# Altium project ECE453-PWR.PrjPcb
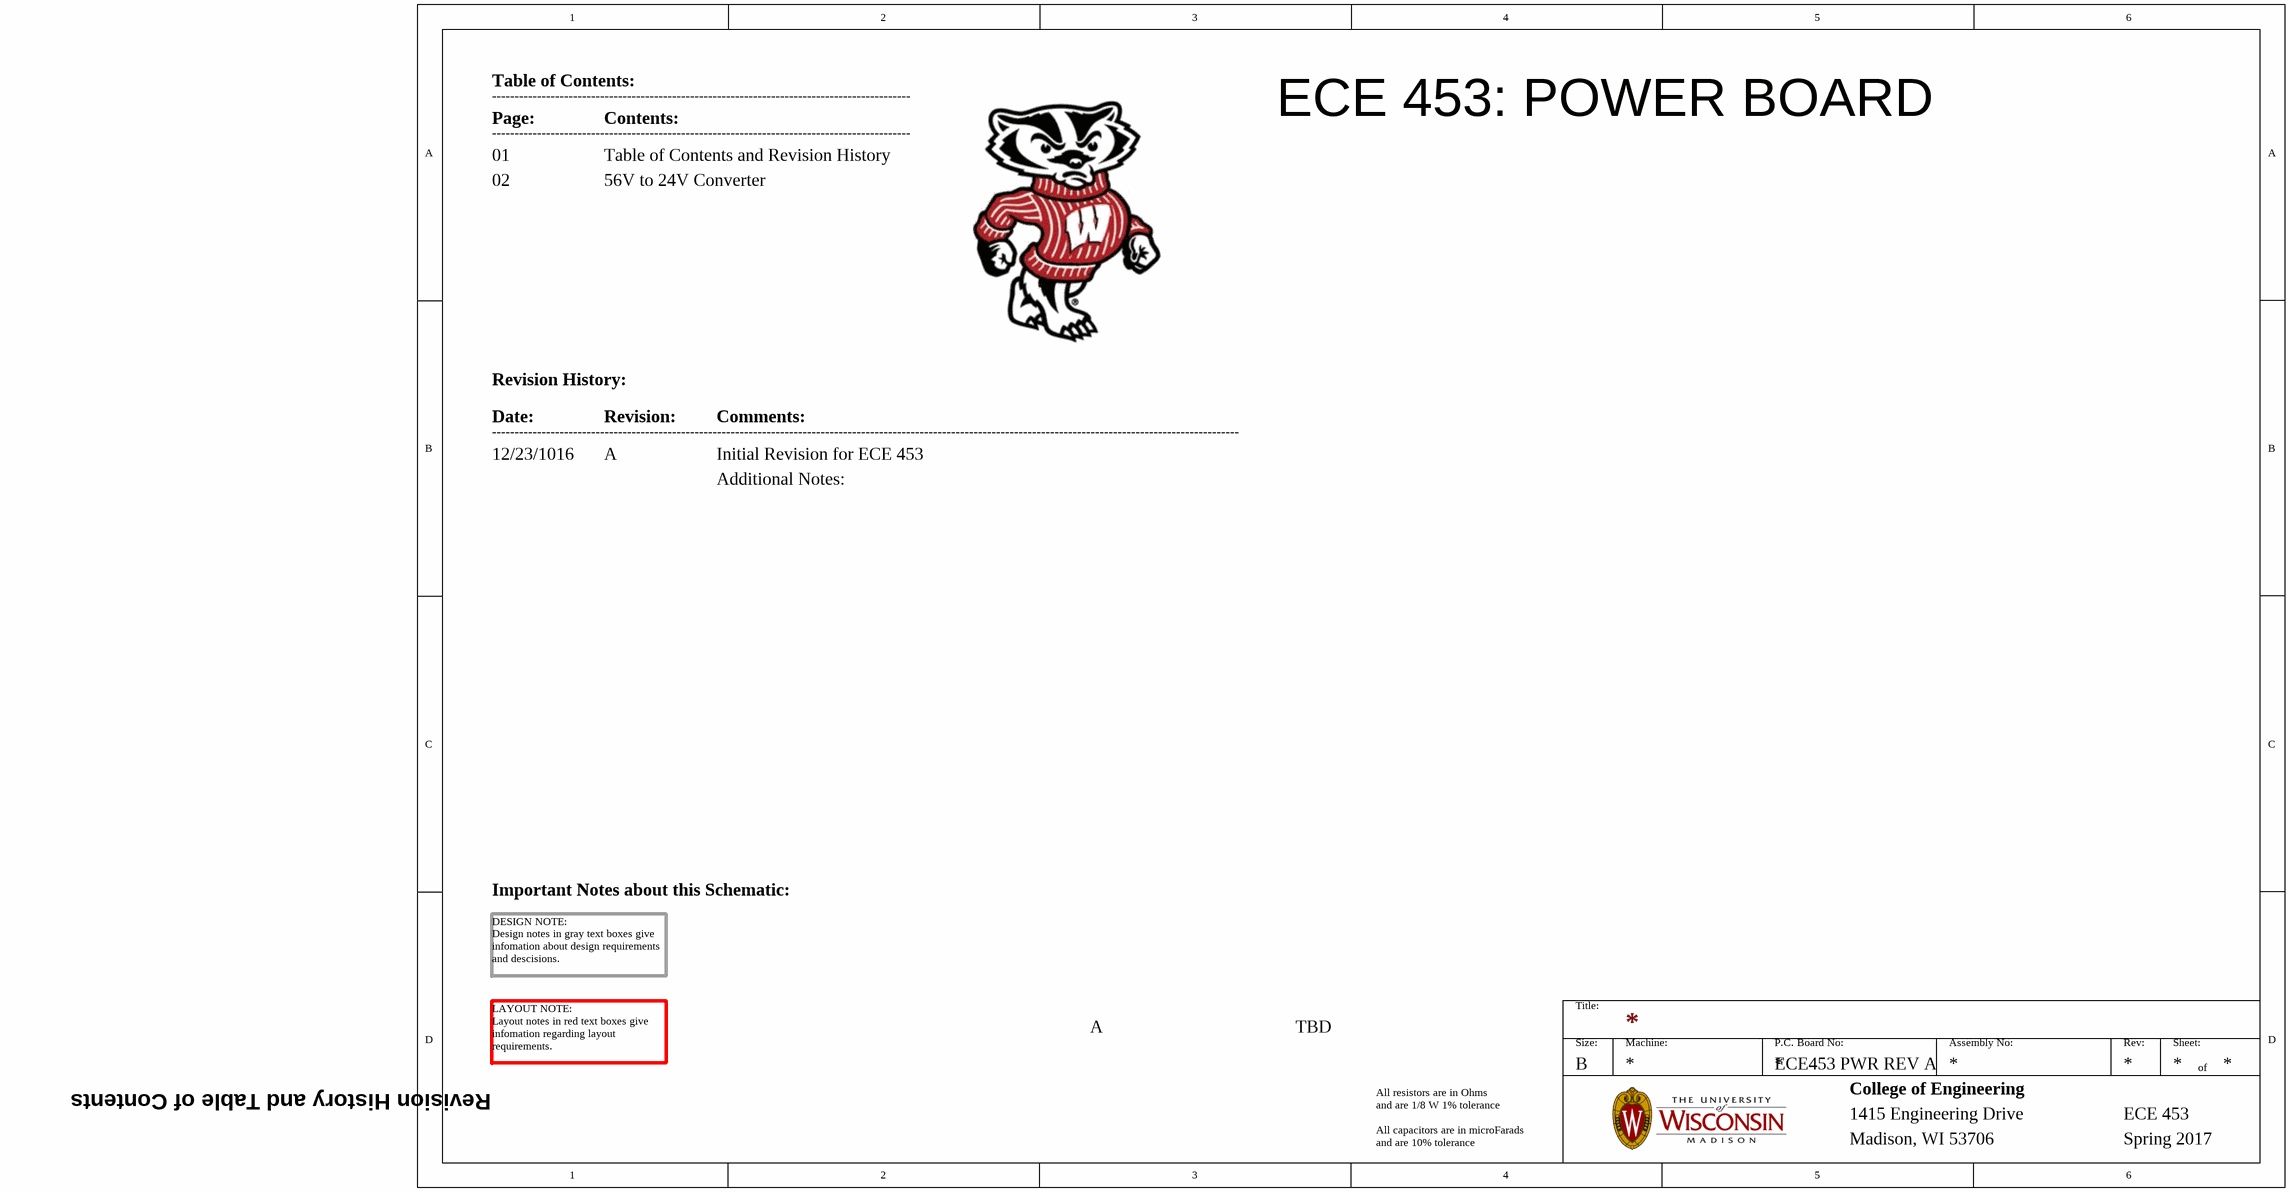
[diagram p0: 01 Revision History and Contents.SchDoc]
3 sheets, 35 parts. Net scope: global (net labels, ports and power ports of the same name join across sheets).
Board file: ECE453_PWR.PcbDoc
Sheets:
  01 Revision History and Contents.SchDoc
  02 56V-24V.SchDoc
  03 24V-5V.SchDoc

## Sheet 01 Revision History and Contents.SchDoc
size B

### Parts
PCB1  value ECE453 PWR REV A  (hidden comment: PMOD F14 REV A)  (mechanical)

### Notes on the sheet
- Table of Contents:
- Page:
- ---------------------------------------------------------------------------------------------
- Contents:
- ECE 453: POWER BOARD
- 01
- 02
- Table of Contents and Revision History
- 56V to 24V Converter
- Revision History:
- Date:
- 12/23/1016
- ----------------------------------------------------------------------------------------------------------------------------------------------------------------------
- Revision:
- A
- Comments:
- Initial Revision for ECE 453
- Additional Notes:
- Important Notes about this Schematic:
- DESIGN NOTE:
  Design notes in gray text boxes give infomation about design requirements and descisions.
- Revision History and Table of Contents
- LAYOUT NOTE:
  Layout notes in red text boxes give infomation regarding layout requirements.
- TBD
- All resistors are in Ohms
- and are 1/8 W 1% tolerance
- All capacitors are in microFarads
- and are 10% tolerance
- ECE 453
- Spring 2017
- Title:
- Size:
- B
- Machine:
- P.C. Board No:
- Assembly No:
- Rev:
- Sheet:
- of
- College of Engineering
- 1415 Engineering Drive
- Madison, WI 53706

### Library data of the parts
PCB1 = PMOD F14 Rev A Bare PCB: ECE 453 Digital Themometer PMOD F14 Rev A Bare PCB; Manufacturer 1: TBD; Supplier 1: TBD; Supplier Part Number 1: N/A; Manufacturer Part Number 1: PMOD F14 REV A; Supplier Unit Price 1: 33; Package: N/A; Tolerance: N/A; Rating: N/A

## Sheet 02 56V-24V.SchDoc: Mezzanine Power
size B; Author: JSK; Revision: A; SheetNumber: 2; SheetTotal: 2; AssemblyNumber: ECE453 Power; CurrentDate: 1/09/2018
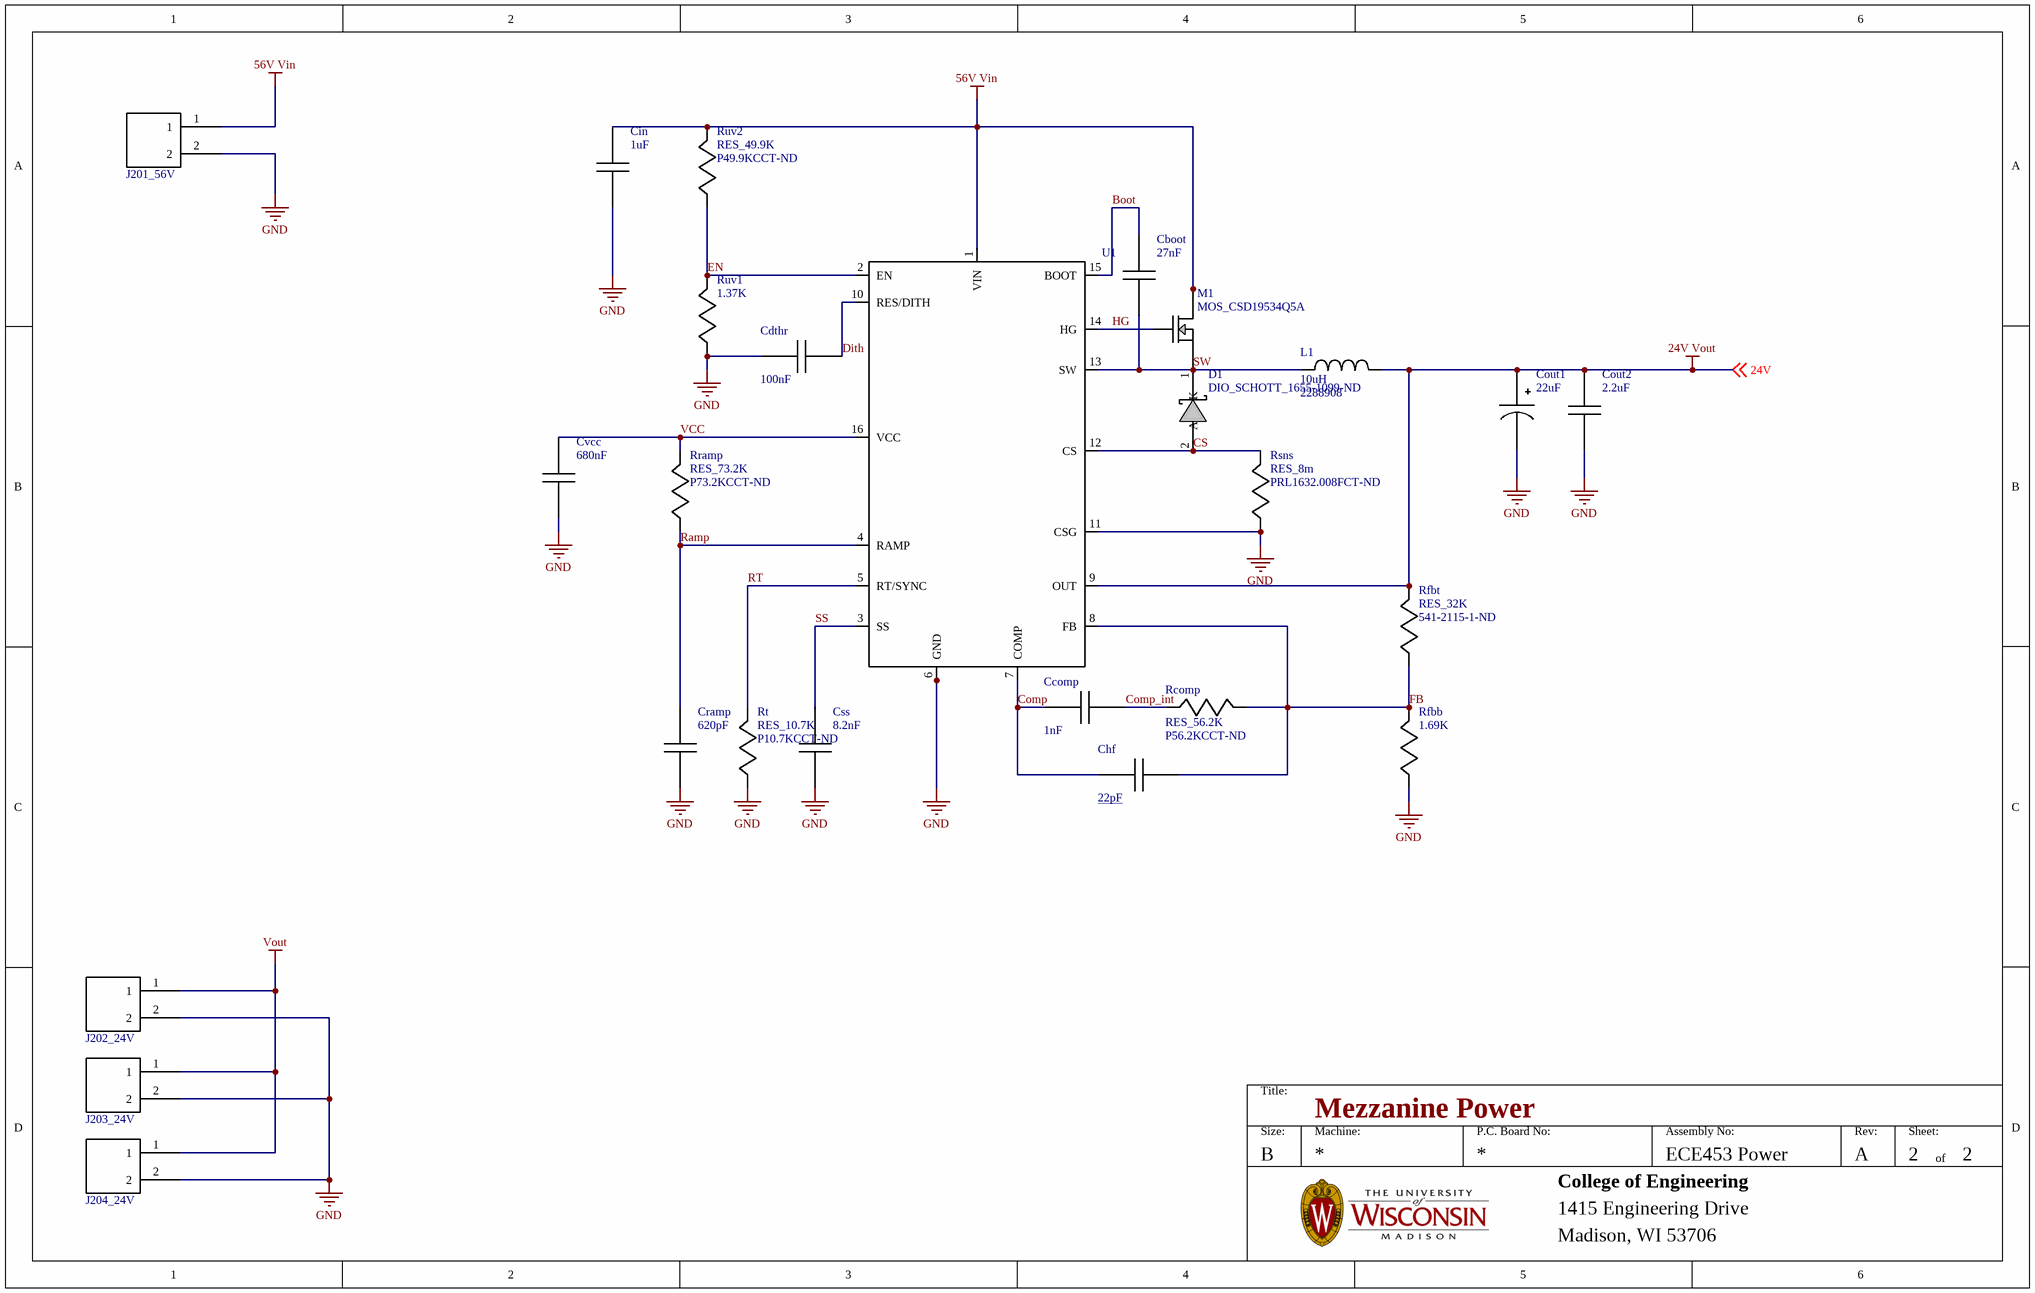
[diagram p1: 02 56V-24V.SchDoc]

### Parts
Cboot  Capacitance: 27nF  [CAP_1812]  (hidden comment: CAP_27nF)
Ccomp  Capacitance: 1nF  [CAP_0805]  (hidden comment: CAP_1nF)
Cdthr  Capacitance: 100nF  [CAP_0805]  (hidden comment: CAP_100nF)
Chf  Capacitance: 22pF  [CAP_0805]  (hidden comment: CAP_22pF)
Cin  Capacitance: 1uF  [CAP_1207]  (hidden comment: CAP_1uF)
Cout1  Capacitance: 22uF  [CAP_RAD_35SVPF22M]  (hidden comment: PCAP_22uF)
Cout2  Capacitance: 2.2uF  [CAP_0805]  (hidden comment: CAP_2.2uF)
Cramp  Capacitance: 620pF  [CAP_0805]  (hidden comment: CAP_620pF)
Css  Capacitance: 8.2nF  [CAP_0805]  (hidden comment: CAP_8.2nF)
Cvcc  Capacitance: 680nF  [CAP_1207]  (hidden comment: CAP_680nF)
D1  DIO_SCHOTT_1655-1099-ND  [DIO_SCHOTT_MBRF10200]
J201_56V  TERMINAL_SCREW_2x1  [TERM_2Pin]  (value not drawn)
J202_24V  TERMINAL_SCREW_2x1  [TERM_2Pin]  (value not drawn)
J203_24V  TERMINAL_SCREW_2x1  [TERM_2Pin]  (value not drawn)
J204_24V  TERMINAL_SCREW_2x1  [TERM_2Pin]  (value not drawn)
L1  Inductance: 10uH  Supplier Part Number 1: 2288908  [IND_SER2900]  (hidden comment: IND_10uH)
M1  MOS_CSD19534Q5A  [MOS_CSD19534Q5A]
Rcomp  RES_56.2K  Supplier Part Number 1: P56.2KCCT-ND  [RES_0805]
Rfbb  Resistance: 1.69K  [RES_0805]  (hidden comment: RES_1.69K)
Rfbt  RES_32K  Supplier Part Number 1: 541-2115-1-ND  [RES_0402]
Rramp  RES_73.2K  Supplier Part Number 1: P73.2KCCT-ND  [RES_0805]
Rsns  RES_8m  Supplier Part Number 1: PRL1632.008FCT-ND  [RES_1206]
Rt  RES_10.7K  Supplier Part Number 1: P10.7KCCT-ND  [RES_0805]
Ruv1  Resistance: 1.37K  [RES_0805]  (hidden comment: RES_1.37K)
Ruv2  RES_49.9K  Supplier Part Number 1: P49.9KCCT-ND  [RES_0805]
U1  BUCK_LM5088QMHX-1/NOP  [BUCK_LM5088]  (value not drawn)

### Nets
24V Vout: Cout1.1(+) Cout2.1 L1.2 Rfbt.1 U1.9(OUT) ; off-sheet 24V  [also labelled 24V]
56V Vin: Cin.1 J201_56V.1 M1.5(Drain) M1.6(Drain) M1.7(Drain) M1.8(Drain) Ruv2.1 U1.1(VIN)
GND: Cdthr.2 Cin.2 Cout1.2(-) Cout2.2 Cramp.2 Css.2 Cvcc.2 J201_56V.2 J202_24V.2 J203_24V.2 J204_24V.2 Rfbb.2 Rsns.2 Rt.2 Ruv1.2 U1.6(GND) U1.11(CSG) U1.17(EP)
Vout: J202_24V.1 J203_24V.1 J204_24V.1
Boot: Cboot.1 U1.15(BOOT)
Comp: Ccomp.2 Chf.2 U1.7(COMP)
Comp_int: Ccomp.1 Rcomp.2
CS: D1.2(A) Rsns.1 U1.12(CS)
Dith: Cdthr.1 U1.10(RES/DITH)
EN: Ruv1.1 Ruv2.2 U1.2(EN)
FB: Chf.1 Rcomp.1 Rfbb.1 Rfbt.2 U1.8(FB)
HG: M1.4(Gate) U1.14(HG)
Ramp: Cramp.1 Rramp.2 U1.4(RAMP)
RT: Rt.1 U1.5(RT/SYNC)
SS: Css.1 U1.3(SS)
SW: Cboot.2 D1.1(K) L1.1 M1.1(Source) M1.2(Source) M1.3(Source) U1.13(SW)
VCC: Cvcc.1 Rramp.1 U1.16(VCC)

### Notes on the sheet
- Title:
- Size:
- B
- Machine:
- P.C. Board No:
- Assembly No:
- Rev:
- Sheet:
- of
- College of Engineering
- 1415 Engineering Drive
- Madison, WI 53706

### Library data of the parts
Cboot = CAP_27nF: Imported; Manufacturer_Part_Number: C1812C273J5GACTU; Vendor: Kemet; Tolerance: ±5%; Voltage - Rated: 50V; Temperature Coefficient: C0G, NP0; Notification: Current market demand for these product types have resulted in fluctuating and extending lead times. Lead times may differ.; Manufacturer_Name: Kemet; RefDes: RefDes; TYPE: TYPE; Value: Value; Supplier 1: Digi-Key; Manufacturer: KEMET; Manufacturer Part Number: C1812C273J5GACTU; RoHS: RoHS Compliant; Category: Capacitors; Stock 1: 1884; Pricing 1: 1=1.94, 10=1.533, 100=1.1499, 500=0.8688 (USD); Packaging: Cut Tape (CT); Part Status: Active; Operating Temperature: -55°C ~ 125°C; Features: Low ESL; Ratings: -; Applications: General Purpose; Failure Rate: -; Mounting Type: Surface Mount, MLCC; Package / Case: 1812 (4532 Metric); Size / Dimension: 0.177" L x 0.126" W (4.50mm x 3.20mm); Height - Seated (Max): -; Thickness (Max): 0.043" (1.10mm); Lead Spacing: -; Lead Style: -; ComponentLink1URL: https://search.kemet.com/component-edge/download/datasheet/C1812C273J5GACTU.pdf; ComponentLink1Description: https://search.kemet.com/component-edge/download/datasheet/C1812C273J5GACTU.pdf; Supplier Part Number 1: 399-5352-1-ND
Ccomp = CAP_1nF: Imported; Manufacturer_Part_Number: C0805C102K5GACTU; Vendor: Kemet; Tolerance: ±10%; Voltage - Rated: 50V; Temperature Coefficient: C0G, NP0; Notification: Current market demand for these product types have resulted in fluctuating and extending lead times. Lead times may differ.; Manufacturer_Name: Kemet; RefDes: RefDes; TYPE: TYPE; Value: Value; Supplier 1: Digi-Key; Manufacturer: KEMET; Manufacturer Part Number: C0805C102K5GACTU; RoHS: RoHS Compliant; Category: Capacitors; Stock 1: 31421; Pricing 1: 1=0.13, 10=0.09, 100=0.0424, 500=0.02972, 1000=0.02461 (USD); Packaging: Cut Tape (CT); Part Status: Active; Operating Temperature: -55°C ~ 125°C; Features: Low ESL; Ratings: -; Applications: General Purpose; Failure Rate: -; Mounting Type: Surface Mount, MLCC; Package / Case: 0805 (2012 Metric); Size / Dimension: 0.079" L x 0.049" W (2.00mm x 1.25mm); Height - Seated (Max): -; Thickness (Max): 0.035" (0.88mm); Lead Spacing: -; Lead Style: -; ComponentLink1URL: https://search.kemet.com/component-edge/download/datasheet/C0805C102K5GACTU.pdf; ComponentLink1Description: https://search.kemet.com/component-edge/download/datasheet/C0805C102K5GACTU.pdf; Supplier Part Number 1: 399-7988-1-ND
Cdthr = CAP_100nF: Imported; Manufacturer_Part_Number: 08053C104JAZ2A; Manufacturer: AVX Corporation; Vendor: AVX; Tolerance: ±5%; Voltage - Rated: 25V; Temperature Coefficient: X7R; Notification: Current market demand for these product types have resulted in fluctuating and extending lead times. Lead times may differ.; Manufacturer_Name: AVX; RefDes: RefDes; TYPE: TYPE; Value: Value; Supplier 1: Digi-Key; Manufacturer Part Number: 08053C104JAZ2A; RoHS: RoHS Compliant; Category: Capacitors; Stock 1: 0; Pricing 1: 4000=0.0864 (USD); Packaging: Tape & Reel (TR); Part Status: Active; Operating Temperature: -55°C ~ 125°C; Features: Soft Termination; Ratings: -; Applications: Boardflex Sensitive; Mounting Type: Surface Mount, MLCC; Package / Case: 0805 (2012 Metric); Size / Dimension: 0.079" L x 0.049" W (2.01mm x 1.25mm); Height - Seated (Max): -; Thickness (Max): 0.037" (0.94mm); Lead Spacing: -; Lead Style: -; ComponentLink1URL: http://datasheets.avx.com/FlexitermMLCC.pdf; ComponentLink1Description: http://datasheets.avx.com/FlexitermMLCC.pdf; Supplier Part Number 1: 08053C104JAZ2A-ND
Chf = CAP_22pF: Imported; Manufacturer_Part_Number: C0805C220K3GACTU; Vendor: Kemet; Tolerance: ±10%; Voltage - Rated: 25V; Temperature Coefficient: C0G, NP0; Notification: Current market demand for these product types have resulted in fluctuating and extending lead times. Lead times may differ.; Manufacturer_Name: Kemet; RefDes: RefDes; TYPE: TYPE; Value: Value; Supplier 1: Digi-Key; Manufacturer: KEMET; Manufacturer Part Number: C0805C220K3GACTU; RoHS: RoHS Compliant; Category: Capacitors; Stock 1: 86290; Pricing 1: 1=0.1, 10=0.072, 100=0.0322, 500=0.02302, 1000=0.01809 (USD); Packaging: Cut Tape (CT); Part Status: Active; Operating Temperature: -55°C ~ 125°C; Features: Low ESL; Ratings: -; Applications: General Purpose; Failure Rate: -; Mounting Type: Surface Mount, MLCC; Package / Case: 0805 (2012 Metric); Size / Dimension: 0.079" L x 0.049" W (2.00mm x 1.25mm); Height - Seated (Max): -; Thickness (Max): 0.035" (0.88mm); Lead Spacing: -; Lead Style: -; ComponentLink1URL: https://search.kemet.com/component-edge/download/datasheet/C0805C220K3GACTU.pdf; ComponentLink1Description: https://search.kemet.com/component-edge/download/datasheet/C0805C220K3GACTU.pdf; Supplier Part Number 1: 399-9190-1-ND
Cin = CAP_1uF: Imported; Manufacturer_Part_Number: C3216X7R2A105K160AA; Manufacturer: TDK Corporation; Vendor: TDK; Tolerance: ±10%; Voltage - Rated: 100V; Temperature Coefficient: X7R; Notification: Current market demand for these product types have resulted in fluctuating and extending lead times. Lead times may differ.; Manufacturer_Name: TDK; RefDes: RefDes; TYPE: TYPE; Value: Value; Supplier 1: Digi-Key; Manufacturer Part Number: C3216X7R2A105K160AA; RoHS: RoHS Compliant; Category: Capacitors; Stock 1: 15982; Pricing 1: 1=0.45, 10=0.316, 100=0.2083, 500=0.15434, 1000=0.13118 (USD); Packaging: Cut Tape (CT); Part Status: Active; Operating Temperature: -55°C ~ 125°C; Features: -; Ratings: -; Applications: General Purpose; Failure Rate: -; Mounting Type: Surface Mount, MLCC; Package / Case: 1206 (3216 Metric); Size / Dimension: 0.126" L x 0.063" W (3.20mm x 1.60mm); Height - Seated (Max): -; Thickness (Max): 0.051" (1.30mm); Lead Spacing: -; Lead Style: -; ComponentLink1URL: https://product.tdk.com/info/en/catalog/datasheets/mlcc_commercial_midvoltage_en.pdf; ComponentLink1Description: https://product.tdk.com/info/en/catalog/datasheets/mlcc_commercial_midvoltage_en.pdf; Supplier Part Number 1: 445-4467-1-ND
Cout1 = PCAP_22uF: Imported; Manufacturer_Part_Number: 35SVPF22M; Manufacturer: Panasonic Electronic Components; Vendor: Panasonic; Tolerance: ±20%; ESR (Equivalent Series Resistance): 35 mOhm; Lifetime @ Temp.: 5000 Hrs @ 105°C; Surface Mount Land Size: 0.260" L x 0.260" W (6.60mm x 6.60mm); Manufacturer_Name: Panasonic; RefDes: RefDes; TYPE: TYPE; Value: Value; Supplier 1: Digi-Key; Manufacturer Part Number: 35SVPF22M; RoHS: RoHS Compliant; Category: Capacitors; Stock 1: 16325; Pricing 1: 1=1.32, 10=1.041, 100=0.7811, 500=0.59018 (USD); Packaging: Cut Tape (CT); Part Status: Active; Operating Temperature: -55°C ~ 105°C; Ratings: -; Applications: General Purpose; Lead Spacing: -; Size / Dimension: 0.248" Dia (6.30mm); Height - Seated (Max): 0.236" (6.00mm); Mounting Type: Surface Mount; Package / Case: Radial, Can - SMD; ComponentLink1URL: http://industrial.panasonic.com/www-cgi/jvcr13pz.cgi?E+CI+4+AAB8001+35SVPF22M+8+WW; ComponentLink1Description: http://industrial.panasonic.com/www-cgi/jvcr13pz.cgi?E+CI+4+AAB8001+35SVPF22M+8+WW; Supplier Part Number 1: P16560CT-ND
Cout2 = CAP_2.2uF: Imported; Manufacturer_Part_Number: C2012X7R1H225K125AC; Manufacturer: TDK Corporation; Vendor: TDK; Tolerance: ±10%; Voltage - Rated: 50V; Temperature Coefficient: X7R; Notification: Current market demand for these product types have resulted in fluctuating and extending lead times. Lead times may differ.; Manufacturer_Name: TDK; RefDes: RefDes; TYPE: TYPE; Value: Value; Supplier 1: Digi-Key; Manufacturer Part Number: C2012X7R1H225K125AC; RoHS: RoHS Compliant; Category: Capacitors; Stock 1: 64990; Pricing 1: 1=0.51, 10=0.351, 100=0.2107, 500=0.158, 1000=0.13343 (USD); Packaging: Cut Tape (CT); Part Status: Active; Operating Temperature: -55°C ~ 125°C; Features: Low ESL; Ratings: -; Applications: General Purpose; Failure Rate: -; Mounting Type: Surface Mount, MLCC; Package / Case: 0805 (2012 Metric); Size / Dimension: 0.079" L x 0.049" W (2.00mm x 1.25mm); Height - Seated (Max): -; Thickness (Max): 0.057" (1.45mm); Lead Spacing: -; Lead Style: -; ComponentLink1URL: https://product.tdk.com/info/en/catalog/datasheets/mlcc_commercial_general_en.pdf; ComponentLink1Description: https://product.tdk.com/info/en/catalog/datasheets/mlcc_commercial_general_en.pdf; Supplier Part Number 1: 445-5968-1-ND
Cramp = CAP_620pF: Imported; Manufacturer_Part_Number: CL21C621JBCNNNC; Vendor: Samsung Electro-Mechanics; Tolerance: ±5%; Voltage - Rated: 50V; Temperature Coefficient: C0G, NP0; Notification: Current market demand for these product types have resulted in fluctuating and extending lead times. Lead times may differ.; Manufacturer_Name: Samsung Electro-Mechanics; RefDes: RefDes; TYPE: TYPE; Value: Value; Supplier 1: Digi-Key; Manufacturer: Samsung Electro-Mechanics; Manufacturer Part Number: CL21C621JBCNNNC; RoHS: RoHS Compliant; Category: Capacitors; Stock 1: 14370; Pricing 1: 1=0.1, 10=0.066, 100=0.0293, 500=0.0209, 1000=0.01643 (USD); Packaging: Cut Tape (CT); Part Status: Active; Operating Temperature: -55°C ~ 125°C; Features: -; Ratings: -; Applications: General Purpose; Mounting Type: Surface Mount, MLCC; Package / Case: 0805 (2012 Metric); Size / Dimension: 0.079" L x 0.049" W (2.00mm x 1.25mm); Height - Seated (Max): -; Thickness (Max): 0.037" (0.95mm); Lead Spacing: -; Lead Style: -; ComponentLink1URL: http://www.samsungsem.com/kr/support/product-search/mlcc/CL21C621JBCNNNC.jsp; ComponentLink1Description: http://www.samsungsem.com/kr/support/product-search/mlcc/CL21C621JBCNNNC.jsp; Supplier Part Number 1: 1276-2677-1-ND
Css = CAP_8.2nF: Imported; Manufacturer: Murata Electronics North America; Manufacturer Part Number: GRM2195C1H822JA01D; Tolerance: ±5%; Voltage - Rated: 50V; Temperature Coefficient: C0G, NP0; Notification: Current market demand for these product types have resulted in fluctuating and extending lead times. Lead times may differ.; Supplier 1: Digi-Key; RoHS: RoHS Compliant; Category: Capacitors; Stock 1: 52724; Pricing 1: 1=0.24, 10=0.167, 100=0.0948, 500=0.06696, 1000=0.05858 (USD); Packaging: Cut Tape (CT); Part Status: Active; Operating Temperature: -55°C ~ 125°C; Features: -; Ratings: -; Applications: General Purpose; Mounting Type: Surface Mount, MLCC; Package / Case: 0805 (2012 Metric); Size / Dimension: 0.079" L x 0.049" W (2.00mm x 1.25mm); Height - Seated (Max): -; Thickness (Max): 0.037" (0.95mm); Lead Spacing: -; Lead Style: -; ComponentLink1URL: https://www.murata.com/~/media/webrenewal/support/library/catalog/products/capacitor/mlcc/c02e.ashx; ComponentLink1Description: https://www.murata.com/~/media/webrenewal/support/library/catalog/products/capacitor/mlcc/c02e.ashx; Supplier Part Number 1: 490-1640-1-ND
Cvcc = CAP_680nF: Imported; Manufacturer_Part_Number: ECPU1C684MA5; Manufacturer: Panasonic Electronic Components; Manufacturer Part Number: ECP-U1C684MA5; Vendor: Panasonic; Tolerance: ±20%; Voltage Rating - DC: 16V; Dielectric Material: Acrylic, Metallized - Stacked; Manufacturer_Name: Panasonic; RefDes: RefDes; TYPE: TYPE; Value: Value; Supplier 1: Digi-Key; RoHS: RoHS Compliant; Category: Capacitors; Stock 1: 39663; Pricing 1: 1=0.81, 10=0.599, 100=0.4104, 500=0.32492, 1000=0.27362 (USD); Packaging: Cut Tape (CT); Part Status: Active; Voltage Rating - AC: -; Operating Temperature: -40°C ~ 85°C; Mounting Type: Surface Mount; Package / Case: 1206 (3216 Metric); Size / Dimension: 0.126" L x 0.063" W (3.20mm x 1.60mm); Height - Seated (Max): 0.063" (1.60mm); Termination: Solder Pads; Lead Spacing: -; Applications: EMI, RFI Suppression; Ratings: -; Features: Low ESR; ComponentLink1URL: http://industrial.panasonic.com/www-cgi/jvcr13pz.cgi?E+PZ+3+ABD0012+ECPU1C684MA5+7+WW; ComponentLink1Description: http://industrial.panasonic.com/www-cgi/jvcr13pz.cgi?E+PZ+3+ABD0012+ECPU1C684MA5+7+WW; Supplier Part Number 1: PCF1131CT-ND
D1 = DIO_SCHOTT_1655-1099-ND: Imported; Manufacturer: SMC Diode Solutions; Manufacturer Part Number: MBRF10200; Diode Type: Schottky; Current - Average Rectified (Io): 10A; Speed: Fast Recovery =< 500ns, > 200mA (Io); Supplier 1: Digi-Key; RoHS: RoHS Compliant; Category: Discrete Semiconductor Products; Stock 1: 0; Pricing 1: 1=0.62, 10=0.524, 25=0.4584, 100=0.3928, 250=0.34044, 500=0.28806, 1000=0.22259, 2500=0.20295, 5000=0.18986 (USD); Packaging: Tube; Part Status: Active; Capacitance @ Vr, F: -; Mounting Type: Through Hole; Package / Case: TO-220-2 Insulated, TO-220AC; Supplier Device Package: ITO-220AC; Operating Temperature - Junction: -55°C ~ 175°C; ComponentLink1URL: http://www.smc-diodes.com/propdf/MBRF10200%20N0838%20REV.B.pdf; ComponentLink1Description: http://www.smc-diodes.com/propdf/MBRF10200%20N0838%20REV.B.pdf; Supplier Part Number 1: 1655-1099-ND
J201_56V J202_24V J203_24V J204_24V = TERMINAL_SCREW_2x1: TERM BLOCK PLUG 2POS STR 5.08MM; Manufacturer: On Shore Technology Inc.; Manufacturer Part Number: OSTTJ025153; Number of Positions: 2; Number of Levels: 1; Pitch: 0.200" (5.08mm); Current - IEC: 20A; Wire Gauge or Range - AWG: 12-24 AWG; Wire Gauge or Range - mm²: 0.34-2.5mm²; Material Flammability Rating: UL94 V-0; Torque - Screw: 0.56 Nm (5.0 Lb-In); Wire Strip Length: 7-8mm; Mating Orientation: Horizontal with Board; Wire Gauge: 10-30 AWG; Wire Termination: Screw; Clamp Material - Plating: Copper - Nickel Plated; Supplier 1: Digi-Key; RoHS: RoHS Compliant; Category: Connectors, Interconnects; Stock 1: 1303; Pricing 1: 1=1.52, 10=1.068, 25=0.996, 50=0.904, 100=0.9, 250=0.76, 500=0.72, 1000=0.64, 5000=0.52 (USD); Packaging: Bulk; Part Status: Active; Type: Plug, Female Sockets; Positions Per Level: 2; Header Orientation: -; Plug Wire Entry: -; Termination Style: Screw; Mounting Type: Screw; Color: Green; Operating Temperature: -30°C ~ 105°C; Contact Mating Finish: Tin; Features: Retention Latches (Non-Wire Side); Ingress Protection: -; Screw Size: -; Contact Material: Brass; Housing Material: Brass; Contact Tail Length: -; Insulation Height: -; ComponentLink1URL: http://www.on-shore.com/wp-content/uploads/2015/09/osttjxx5153.pdf; ComponentLink1Description: http://www.on-shore.com/wp-content/uploads/2015/09/osttjxx5153.pdf; Supplier Part Number 1: WM13946-ND; Contact Material - Plating: Copper - Tin Plated; Screw Material - Plating: Copper - Nickel Plated; Screw Thread: -; ComponentLink2URL: http://www.molex.com/pdm_docs/sd/393900102_sd.pdf; ComponentLink2Description: http://www.molex.com/pdm_docs/sd/393900102_sd.pdf
L1 = IND_10uH: Imported; Manufacturer_Part_Number: SER2915L-103KL; Vendor: Coilcraft; RMS Current (Irms): 30; Inductor Construction: Shielded; Saturation Current (Isat): 13; Product Range: SER2900 Series; Power Inductor Case: 27.9mm x 19.8mm x 15.36; DC Resistance Max: 1650; Inductance Tolerance: ± 10%; SVHC: No SVHC (12-Jan-2017); Automotive Qualification Standard: AEC-Q200; Self Resonant Frequency Min: 20MHz<!--FANDB--><div class="features-and-benefits-container"><div class="features-and-benefits-description"><span class="features-benefits-value">The SER2915L-103KL is a surface mount shielded Power Inductor with ferrite core. This inductor features tin-silver over copper terminations and is resistance to soldering heat maximum three 40 seconds reflows at +260°C, parts cooled to room temperature between cycles. This inductor also features moisture sensitivity level (MSL) of 1, failures in time (FIT)/mean time between failures (MTBF) is 38 per billion hours/26,315,789 hours, calculated per Telcordia SR-332 and tested with pure water or alcohol only foe wash. Peak dc current at which the inductance drops the specified amount from its value without current and inductance measured at 500kHz, 0.1Vrms, 0ADC on an Agilent/HP 4284; Manufacturer_Name: Coilcraft; RefDes: RefDes; TYPE: TYPE; Value: Value; Supplier 1: Farnell; Manufacturer: COILCRAFT; Manufacturer Part Number: SER2915L-103KL; RoHS: YES; Packaging: Each; ComponentLink1URL: http://www.farnell.com/datasheets/1681984.pdf; ComponentLink1Description: http://www.farnell.com/datasheets/1681984.pdf
M1 = MOS_CSD19534Q5A: Imported; VdsMax: 100.0V; IdsMax: 10.0A; Rdsonat10V: 0.012Ohm; QgTyp: 17nC; Vendor: Texas Instruments; FET Type: N-Channel; Current - Continuous Drain (Id) @ 25°C: 50A (Ta); Drive Voltage (Max Rds On,  Min Rds On): 6V, 10V; Vgs(th) (Max) @ Id: 3.4V @ 250µA; Vgs (Max): ±20V; Power Dissipation (Max): 3.2W (Ta), 63W (Tc); Rds On (Max) @ Id, Vgs: 15.1 mOhm @ 10A, 10V; Datasheet_URL: http://www.ti.com/lit/ds/symlink/CSD19534Q5A.pdf; Quantity: 1; Manufacturer_Part_Number: CSD19534Q5A; Manufacturer_Name: Texas Instruments; RefDes: RefDes; TYPE: TYPE; Value: Value; Supplier 1: Digi-Key; Manufacturer: Texas Instruments; Manufacturer Part Number: CSD19534Q5A; RoHS: RoHS Compliant; Category: Discrete Semiconductor Products; Stock 1: 307; Pricing 1: 1=1.18, 10=1.043, 100=0.8244, 500=0.63936, 1000=0.50475 (USD); Packaging: Cut Tape (CT); Part Status: Active; Technology: MOSFET (Metal Oxide); FET Feature: -; Operating Temperature: -55°C ~ 150°C (TJ); Mounting Type: Surface Mount; Supplier Device Package: 8-VSON (5x6); Package / Case: 8-PowerTDFN; ComponentLink1URL: http://www.ti.com/lit/ds/symlink/csd19534q5a.pdf; ComponentLink1Description: http://www.ti.com/lit/ds/symlink/csd19534q5a.pdf; Supplier Part Number 1: 296-43636-1-ND
Rcomp = RES_56.2K: Imported; Manufacturer_Part_Number: ERJ-6ENF5622V; Manufacturer: Panasonic Electronic Components; Vendor: Panasonic; Tolerance: ±1%; Power (Watts): 0.125W, 1/8W; Temperature Coefficient: ±100ppm/°C; Manufacturer_Name: Panasonic; RefDes: RefDes; TYPE: TYPE; Value: Value; Supplier 1: Digi-Key; Manufacturer Part Number: ERJ-6ENF5622V; RoHS: RoHS Compliant; Category: Resistors; Stock 1: 45392; Pricing 1: 1=0.1, 10=0.079, 100=0.0305, 1000=0.0134, 2500=0.01157 (USD); Packaging: Cut Tape (CT); Part Status: Active; Composition: Thick Film; Features: Automotive AEC-Q200; Operating Temperature: -55°C ~ 155°C; Package / Case: 0805 (2012 Metric); Supplier Device Package: 0805; Size / Dimension: 0.079" L x 0.049" W (2.00mm x 1.25mm); Height - Seated (Max): 0.028" (0.70mm); Failure Rate: -; ComponentLink1URL: https://industrial.panasonic.com/cdbs/www-data/pdf/RDA0000/AOA0000C304.pdf; ComponentLink1Description: https://industrial.panasonic.com/cdbs/www-data/pdf/RDA0000/AOA0000C304.pdf
Rfbb = RES_1.69K: Imported; Manufacturer_Part_Number: ERJ-6ENF1691V; Manufacturer: Panasonic Electronic Components; Vendor: Panasonic; Tolerance: ±1%; Power (Watts): 0.125W, 1/8W; Temperature Coefficient: ±100ppm/°C; Manufacturer_Name: Panasonic; RefDes: RefDes; TYPE: TYPE; Value: Value; Supplier 1: Digi-Key; Manufacturer Part Number: ERJ-6ENF1691V; RoHS: RoHS Compliant; Category: Resistors; Stock 1: 49948; Pricing 1: 1=0.1, 10=0.079, 100=0.0305, 1000=0.0134, 2500=0.01157 (USD); Packaging: Cut Tape (CT); Part Status: Active; Composition: Thick Film; Features: Automotive AEC-Q200; Operating Temperature: -55°C ~ 155°C; Package / Case: 0805 (2012 Metric); Supplier Device Package: 0805; Size / Dimension: 0.079" L x 0.049" W (2.00mm x 1.25mm); Height - Seated (Max): 0.028" (0.70mm); Failure Rate: -; ComponentLink1URL: https://industrial.panasonic.com/cdbs/www-data/pdf/RDA0000/AOA0000C304.pdf; ComponentLink1Description: https://industrial.panasonic.com/cdbs/www-data/pdf/RDA0000/AOA0000C304.pdf; Supplier Part Number 1: P1.69KCCT-ND
Rfbt = RES_32K: Imported; Manufacturer: Vishay Dale; Manufacturer Part Number: TNPW040232K0BEED; Tolerance: ±0.1%; Power (Watts): 0.1W, 1/10W; Temperature Coefficient: ±25ppm/°C; Supplier 1: Digi-Key; RoHS: RoHS Compliant; Category: Resistors; Stock 1: 593; Pricing 1: 1=0.65, 10=0.462, 100=0.2402, 1000=0.12936, 2500=0.1276 (USD); Packaging: Cut Tape (CT); Part Status: Active; Composition: Thin Film; Features: Anti-Sulfur, Automotive AEC-Q200, Moisture Resistant; Operating Temperature: -55°C ~ 155°C; Package / Case: 0402 (1005 Metric); Supplier Device Package: 0402; Size / Dimension: 0.039" L x 0.020" W (1.00mm x 0.50mm); Height - Seated (Max): 0.016" (0.40mm); Failure Rate: -; ComponentLink1URL: http://www.vishay.com/docs/28758/tnpw_e3.pdf; ComponentLink1Description: http://www.vishay.com/docs/28758/tnpw_e3.pdf
Rramp = RES_73.2K: Imported; Manufacturer_Part_Number: ERJ-6ENF7322V; Manufacturer: Panasonic Electronic Components; Vendor: Panasonic; Tolerance: ±1%; Power (Watts): 0.125W, 1/8W; Temperature Coefficient: ±100ppm/°C; Manufacturer_Name: Panasonic; RefDes: RefDes; TYPE: TYPE; Value: Value; Supplier 1: Digi-Key; Manufacturer Part Number: ERJ-6ENF7322V; RoHS: RoHS Compliant; Category: Resistors; Stock 1: 3056; Pricing 1: 1=0.1, 10=0.079, 100=0.0305, 1000=0.0134, 2500=0.01157 (USD); Packaging: Cut Tape (CT); Part Status: Active; Composition: Thick Film; Features: Automotive AEC-Q200; Operating Temperature: -55°C ~ 155°C; Package / Case: 0805 (2012 Metric); Supplier Device Package: 0805; Size / Dimension: 0.079" L x 0.049" W (2.00mm x 1.25mm); Height - Seated (Max): 0.028" (0.70mm); Failure Rate: -; ComponentLink1URL: https://industrial.panasonic.com/cdbs/www-data/pdf/RDA0000/AOA0000C304.pdf; ComponentLink1Description: https://industrial.panasonic.com/cdbs/www-data/pdf/RDA0000/AOA0000C304.pdf
Rsns = RES_8m: Imported; Manufacturer_Part_Number: PRL1632-R008-F-T1; Manufacturer: Susumu; Vendor: Susumu Co Ltd; Tolerance: ±1%; Power (Watts): 1W; Temperature Coefficient: 0/ +350ppm/°C; Manufacturer_Name: Susumu Co Ltd; RefDes: RefDes; TYPE: TYPE; Value: Value; Supplier 1: Digi-Key; Manufacturer Part Number: PRL1632-R008-F-T1; RoHS: RoHS Compliant; Category: Resistors; Stock 1: 11692; Pricing 1: 1=0.65, 10=0.546, 25=0.4676, 50=0.421, 100=0.3664, 250=0.32744, 500=0.26508 (USD); Packaging: Cut Tape (CT); Part Status: Active; Composition: Thin Film; Features: Current Sense; Operating Temperature: -55°C ~ 125°C; Package / Case: Wide 1206 (3216 Metric), 0612; Supplier Device Package: 1206; Size / Dimension: 0.063" L x 0.126" W (1.60mm x 3.20mm); Height - Seated (Max): 0.024" (0.60mm); Failure Rate: -; ComponentLink1URL: http://www.susumu.co.jp/common/pdf/n_catalog_partition07_en.pdf; ComponentLink1Description: http://www.susumu.co.jp/common/pdf/n_catalog_partition07_en.pdf
Rt = RES_10.7K: Imported; Manufacturer_Part_Number: ERJ-6ENF1072V; Manufacturer: Panasonic Electronic Components; Vendor: Panasonic; Tolerance: ±1%; Power (Watts): 0.125W, 1/8W; Temperature Coefficient: ±100ppm/°C; Manufacturer_Name: Panasonic; RefDes: RefDes; TYPE: TYPE; Value: Value; Supplier 1: Digi-Key; Manufacturer Part Number: ERJ-6ENF1072V; RoHS: RoHS Compliant; Category: Resistors; Stock 1: 71566; Pricing 1: 1=0.1, 10=0.079, 100=0.0305, 1000=0.0134, 2500=0.01157 (USD); Packaging: Cut Tape (CT); Part Status: Active; Composition: Thick Film; Features: Automotive AEC-Q200; Operating Temperature: -55°C ~ 155°C; Package / Case: 0805 (2012 Metric); Supplier Device Package: 0805; Size / Dimension: 0.079" L x 0.049" W (2.00mm x 1.25mm); Height - Seated (Max): 0.028" (0.70mm); Failure Rate: -; ComponentLink1URL: https://industrial.panasonic.com/cdbs/www-data/pdf/RDA0000/AOA0000C304.pdf; ComponentLink1Description: https://industrial.panasonic.com/cdbs/www-data/pdf/RDA0000/AOA0000C304.pdf
Ruv1 = RES_1.37K: Imported; Manufacturer_Part_Number: CRCW08051K37FKEA; Manufacturer: Vishay Dale; Vendor: Vishay-Dale; Tolerance: ±1%; Power (Watts): 0.125W, 1/8W; Temperature Coefficient: ±100ppm/°C; Manufacturer_Name: Vishay-Dale; RefDes: RefDes; TYPE: TYPE; Value: Value; Supplier 1: Digi-Key; Manufacturer Part Number: CRCW08051K37FKEA; RoHS: RoHS Compliant; Category: Resistors; Stock 1: 34800; Pricing 1: 1=0.1, 10=0.055, 100=0.0223, 1000=0.01003, 2500=0.0087 (USD); Packaging: Cut Tape (CT); Part Status: Active; Composition: Thick Film; Features: Automotive AEC-Q200; Operating Temperature: -55°C ~ 155°C; Package / Case: 0805 (2012 Metric); Supplier Device Package: 0805; Size / Dimension: 0.079" L x 0.049" W (2.00mm x 1.25mm); Height - Seated (Max): 0.020" (0.50mm); Failure Rate: -; ComponentLink1URL: http://www.vishay.com/docs/20035/dcrcwe3.pdf; ComponentLink1Description: http://www.vishay.com/docs/20035/dcrcwe3.pdf; Supplier Part Number 1: 541-1.37KCCT-ND
Ruv2 = RES_49.9K: Imported; Manufacturer_Part_Number: ERJ-6ENF4992V; Manufacturer: Panasonic Electronic Components; Vendor: Panasonic; Tolerance: ±1%; Power (Watts): 0.125W, 1/8W; Temperature Coefficient: ±100ppm/°C; Manufacturer_Name: Panasonic; RefDes: RefDes; TYPE: TYPE; Value: Value; Supplier 1: Digi-Key; Manufacturer Part Number: ERJ-6ENF4992V; RoHS: RoHS Compliant; Category: Resistors; Stock 1: 218763; Pricing 1: 1=0.1, 10=0.079, 100=0.0305, 1000=0.0134, 2500=0.01157 (USD); Packaging: Cut Tape (CT); Part Status: Active; Composition: Thick Film; Features: Automotive AEC-Q200; Operating Temperature: -55°C ~ 155°C; Package / Case: 0805 (2012 Metric); Supplier Device Package: 0805; Size / Dimension: 0.079" L x 0.049" W (2.00mm x 1.25mm); Height - Seated (Max): 0.028" (0.70mm); Failure Rate: -; ComponentLink1URL: https://industrial.panasonic.com/cdbs/www-data/pdf/RDA0000/AOA0000C304.pdf; ComponentLink1Description: https://industrial.panasonic.com/cdbs/www-data/pdf/RDA0000/AOA0000C304.pdf
U1 = BUCK_LM5088QMHX-1/NOP: Imported; Manufacturer_Part_Number: LM5088MHX-2/NOPB; Manufacturer Part Number: LM5088QMHX-1/NOPB; Vendor: Texas Instruments; Output Type: Transistor Driver; Function: Step-Down; Output Configuration: Positive; Topology: Buck; Output Phases: 1; Voltage - Supply (Vcc/Vdd): 4.5 V ~ 75 V; Frequency - Switching: 50kHz ~ 1MHz; Synchronous Rectifier: No; Clock Sync: Yes; Control Features: Enable, Frequency Control, Ramp, Soft Start; Manufacturer_Name: Texas Instruments; RefDes: RefDes; TYPE: TYPE; Value: Value; Supplier 1: Digi-Key; Manufacturer: Texas Instruments; RoHS: RoHS Compliant; Category: Integrated Circuits (ICs); Stock 1: 0; Pricing 1: 2500=1.81625 (USD); Packaging: Tape & Reel (TR); Part Status: Active; Duty Cycle (Max): -; Serial Interfaces: -; Operating Temperature: -40°C ~ 125°C (TJ); Package / Case: 16-TSSOP (0.173", 4.40mm Width) Exposed Pad; Supplier Device Package: 16-HTSSOP; Base Part Number: LM5088; ComponentLink1URL: http://www.ti.com/lit/ds/symlink/lm5088.pdf; ComponentLink1Description: http://www.ti.com/lit/ds/symlink/lm5088.pdf; Supplier Part Number 1: LM5088QMHX-1/NOPB-ND

## Sheet 03 24V-5V.SchDoc
size A
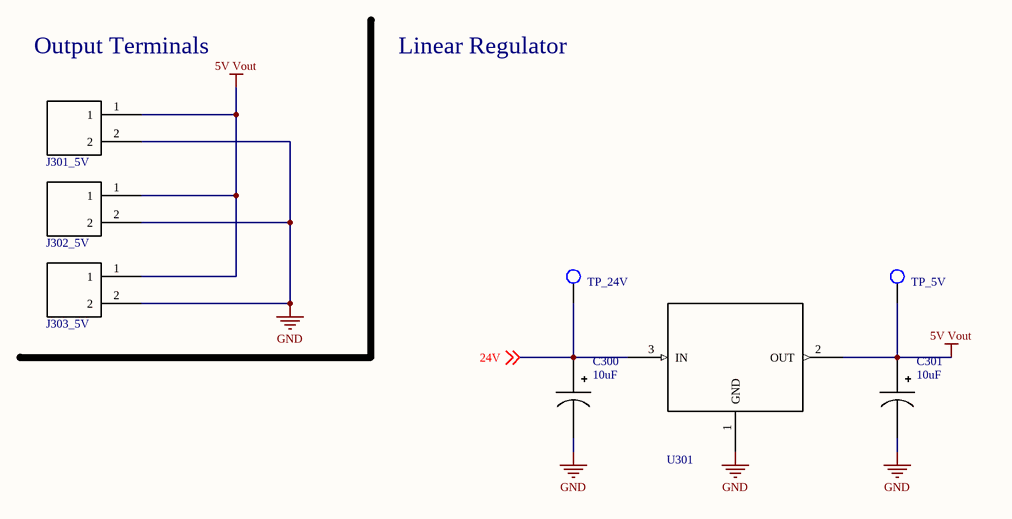
[diagram p2: 03 24V-5V.SchDoc]

### Parts
C300  Capacitance: 10uF  [CAP_1207_POL]  (hidden comment: CAP_10uF_TANT)
C301  Capacitance: 10uF  [CAP_1207_POL]  (hidden comment: CAP_10uF_TANT)
J301_5V  TERMINAL_SCREW_2x1  [TERM_2Pin]  (value not drawn)
J302_5V  TERMINAL_SCREW_2x1  [TERM_2Pin]  (value not drawn)
J303_5V  TERMINAL_SCREW_2x1  [TERM_2Pin]  (value not drawn)
TP_5V  TP_1206  [TP-SMC-1206]  (value not drawn)
TP_24V  TP_1206  [TP-SMC-1206]  (value not drawn)
U301  BUCK_LM1084IS-5.0  [BUCK_5V_OUT_FIXED]  (value not drawn)

### Nets
5V Vout: C301.1(+) J301_5V.1 J302_5V.1 J303_5V.1 TP_5V.1 U301.2(OUT)
24V: C300.1(+) TP_24V.1 U301.3(IN) ; off-sheet 24V  [project net 24V Vout]
GND: C300.2(-) C301.2(-) J301_5V.2 J302_5V.2 J303_5V.2 U301.1(GND)

### Notes on the sheet
- Output Terminals
- Linear Regulator

### Library data of the parts
C300 C301 = CAP_10uF_TANT: Manufacturer: AVX Corporation; Manufacturer Part Number: F951E106MAAAQ2; Manufacturer Size Code: A; Tolerance: ±20%; Type: Conformal Coated; ESR (Equivalent Series Resistance): 2 Ohm; Notification: Current market demand for these product types have resulted in fluctuating and extending lead times. Lead times may differ.; Supplier 1: Digi-Key; RoHS: RoHS Compliant; Category: Capacitors; Stock 1: 23690; Pricing 1: 1=1.01, 10=0.766, 100=0.5477, 500=0.42406, 1000=0.36516 (USD); Packaging: Cut Tape (CT); Part Status: Active; Operating Temperature: -55°C ~ 125°C; Lifetime @ Temp.: -; Mounting Type: Surface Mount; Package / Case: 1206 (3216 Metric); Size / Dimension: 0.126" L x 0.067" W (3.20mm x 1.70mm); Height - Seated (Max): 0.063" (1.60mm); Lead Spacing: -; Features: General Purpose; Failure Rate: -; ComponentLink1URL: http://datasheets.avx.com/F95.pdf; ComponentLink1Description: http://datasheets.avx.com/F95.pdf; Supplier Part Number 1: 478-8496-1-ND
J301_5V J302_5V J303_5V = TERMINAL_SCREW_2x1: TERM BLOCK PLUG 2POS STR 5.08MM; Manufacturer: On Shore Technology Inc.; Manufacturer Part Number: OSTTJ025153; Number of Positions: 2; Number of Levels: 1; Pitch: 0.200" (5.08mm); Current - IEC: 20A; Wire Gauge or Range - AWG: 12-24 AWG; Wire Gauge or Range - mm²: 0.34-2.5mm²; Material Flammability Rating: UL94 V-0; Torque - Screw: 0.56 Nm (5.0 Lb-In); Wire Strip Length: 7-8mm; Mating Orientation: Horizontal with Board; Wire Gauge: 10-30 AWG; Wire Termination: Screw; Clamp Material - Plating: Copper - Nickel Plated; Description: EUROSTYLE 9.53 FIXED PIN 2 CIR; RoHS: RoHS Compliant; Category: Connectors, Interconnects; Packaging: Bulk; Part Status: Active; Type: Plug, Female Sockets; Positions Per Level: 2; Header Orientation: -; Plug Wire Entry: -; Termination Style: Screw; Mounting Type: Screw; Color: Green; Operating Temperature: -30°C ~ 105°C; Contact Mating Finish: Tin; Features: Retention Latches (Non-Wire Side); Ingress Protection: -; Screw Size: -; Contact Material: Brass; Housing Material: Brass; Contact Tail Length: -; Insulation Height: -; ComponentLink1URL: http://www.on-shore.com/wp-content/uploads/2015/09/osttjxx5153.pdf; ComponentLink1Description: http://www.on-shore.com/wp-content/uploads/2015/09/osttjxx5153.pdf; Supplier 1: Digi-Key; Stock 1: 1303; Pricing 1: 1=1.52, 10=1.068, 25=0.996, 50=0.904, 100=0.9, 250=0.76, 500=0.72, 1000=0.64, 5000=0.52 (USD); Contact Material - Plating: Copper - Tin Plated; Screw Material - Plating: Copper - Nickel Plated; Screw Thread: -; ComponentLink2URL: http://www.molex.com/pdm_docs/sd/393900102_sd.pdf; ComponentLink2Description: http://www.molex.com/pdm_docs/sd/393900102_sd.pdf; Supplier Part Number 1: WM13946-ND
TP_5V TP_24V = TP_1206: Test Point SMD 1206; Manufacturer: TE Connectivity (Tyco Electronics); Manufacturer Part Number: 1625854-1; Resistance Value: 0 Ohm; Temperature Coefficient: N/R; Supplier 1: Digi-Key; Stock 1: 31937; Pricing 1: 1=0.28, 10=0.261, 25=0.224, 50=0.1902, 100=0.1828, 250=0.1641, 500=0.1567, 1000=0.1306 (USD); Case Size: 1206; Dimension: 3.2 x 1.6 x 1.25mm; Family: RC; Mounting: Surface Mount; Operating Temperature: -55 to 125 C; Part No: 1625854-1; RoHS: Yes; Packaging: Tape and Reel; Termination Style: N/R; Terminal Pitch: N/R; Power Rating: N/R; Tolerance: N/R; ComponentLink1URL: https://datasheet.ciiva.com/6439/eng-ds-1773266-a-6439169.pdf; ComponentLink1Description: https://datasheet.ciiva.com/6439/eng-ds-1773266-a-6439169.pdf; ComponentLink2URL: https://datasheet.ciiva.com/30136/1773266-a-30136341.pdf; ComponentLink2Description: https://datasheet.ciiva.com/30136/1773266-a-30136341.pdf; ComponentLink3URL: https://datasheet.ciiva.com/6439/eng-ds-1773266-a-6439080.pdf; ComponentLink3Description: https://datasheet.ciiva.com/6439/eng-ds-1773266-a-6439080.pdf; ComponentLink4URL: https://datasheet.ciiva.com/6439/eng-ds-1773266-a-6439081.pdf; ComponentLink4Description: https://datasheet.ciiva.com/6439/eng-ds-1773266-a-6439081.pdf; ComponentLink5URL: https://datasheet.ciiva.com/6439/eng-ds-1773266-a-6439083.pdf; ComponentLink5Description: https://datasheet.ciiva.com/6439/eng-ds-1773266-a-6439083.pdf; Supplier Part Number 1: A106143CT-ND
U301 = BUCK_LM1084IS-5.0: Manufacturer: Texas Instruments; Manufacturer Part Number: LM1084ISX-5.0/NOPB; Output Configuration: Positive; Output Type: Fixed; Voltage - Input (Max): 25V; Voltage - Output (Min/Fixed): 5V; Voltage Dropout (Max): 1.5V @ 5A; Current - Output: 5A; PSRR: 68dB (120Hz); Protection Features: Over Current, Over Temperature; Supplier 1: Digi-Key; RoHS: RoHS Compliant; Category: Integrated Circuits (ICs); Stock 1: 431; Pricing 1: 1=2.73, 10=2.451, 100=1.9701 (USD); Packaging: Cut Tape (CT); Part Status: Active; Voltage - Output (Max): -; Control Features: -; Operating Temperature: -40°C ~ 125°C; Mounting Type: Surface Mount; Package / Case: TO-263-4, D²Pak (3 Leads + Tab), TO-263AA; Supplier Device Package: DDPAK/TO-263-3; Base Part Number: LM1084; ComponentLink1URL: http://www.ti.com/lit/ds/symlink/lm1084.pdf; ComponentLink1Description: http://www.ti.com/lit/ds/symlink/lm1084.pdf; Supplier Part Number 1: LM1084ISX-5.0/NOPBCT-ND

## Nets that join several sheets
24V Vout: 02 56V-24V (5 pins), 03 24V-5V (C300.1 TP_24V.1 U301.3)
GND: 02 56V-24V (18 pins), 03 24V-5V (6 pins)